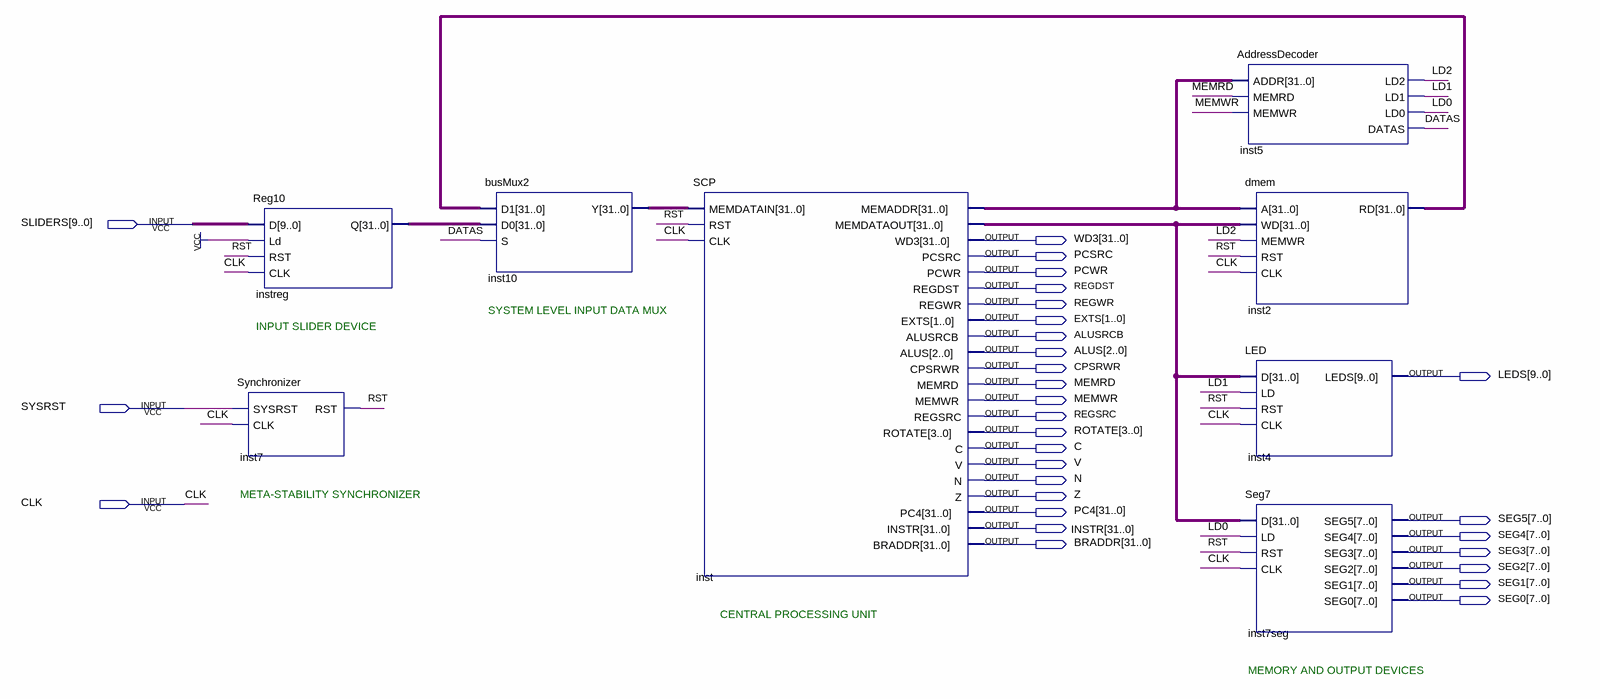
[diagram p0: schematic sheet]
// Quartus schematic DE10Computer.bdf as structural Verilog: 8 symbols, 30 pins
module DE10Computer (
  input  [9:0] SLIDERS,
  input  SYSRST,
  input  CLK,
  output [31:0] WD3,
  output PCSRC,
  output PCWR,
  output REGDST,
  output REGWR,
  output [1:0] EXTS,
  output ALUSRCB,
  output [2:0] ALUS,
  output CPSRWR,
  output [9:0] LEDS,
  output MEMRD,
  output MEMWR,
  output REGSRC,
  output [3:0] ROTATE,
  output C,
  output V,
  output N,
  output Z,
  output [31:0] PC4,
  output [7:0] SEG5,
  output [31:0] INSTR,
  output [7:0] SEG4,
  output [31:0] BRADDR,
  output [7:0] SEG3,
  output [7:0] SEG2,
  output [7:0] SEG1,
  output [7:0] SEG0
);

  wire DATAS, LD0, LD1, LD2, RST;
  wire [31:0] inst2_rd, inst10_y, inst_memaddr, inst_memdataout, instreg_q;

  Reg10 instreg (.D(SLIDERS), .Ld(1'b1), .RST(RST), .CLK(CLK), .Q(instreg_q));
  Synchronizer inst7 (.SYSRST(SYSRST), .CLK(CLK), .RST(RST));
  busMux2 inst10 (.D1(inst2_rd), .D0(instreg_q), .S(DATAS), .Y(inst10_y));
  SCP inst (
    .MEMDATAIN(inst10_y), .RST(RST), .CLK(CLK), .MEMADDR(inst_memaddr), .MEMDATAOUT(inst_memdataout),
    .WD3(WD3), .PCSRC(PCSRC), .PCWR(PCWR), .REGDST(REGDST), .REGWR(REGWR), .EXTS(EXTS), .ALUSRCB(ALUSRCB),
    .ALUS(ALUS), .CPSRWR(CPSRWR), .MEMRD(MEMRD), .MEMWR(MEMWR), .REGSRC(REGSRC), .ROTATE(ROTATE), .C(C),
    .V(V), .N(N), .Z(Z), .PC4(PC4), .INSTR(INSTR), .BRADDR(BRADDR));
  AddressDecoder inst5 (
    .ADDR(inst_memaddr), .MEMRD(MEMRD), .MEMWR(MEMWR), .LD2(LD2), .LD1(LD1), .LD0(LD0), .DATAS(DATAS));
  dmem inst2 (.A(inst_memaddr), .WD(inst_memdataout), .MEMWR(LD2), .RST(RST), .CLK(CLK), .RD(inst2_rd));
  LED inst4 (.D(inst_memdataout), .LD(LD1), .RST(RST), .CLK(CLK), .LEDS(LEDS));
  Seg7 inst7seg (
    .D(inst_memdataout), .LD(LD0), .RST(RST), .CLK(CLK), .SEG5(SEG5), .SEG4(SEG4), .SEG3(SEG3), .SEG2(SEG2),
    .SEG1(SEG1), .SEG0(SEG0));

  // Notes on the sheet:
  //   SYSTEM LEVEL INPUT DATA MUX
  //   INPUT SLIDER DEVICE
  //   META-STABILITY SYNCHRONIZER
  //   CENTRAL PROCESSING UNIT
  //   MEMORY AND OUTPUT DEVICES
endmodule
